# EAGLE design Outlet (EAGLE 7.5.0)
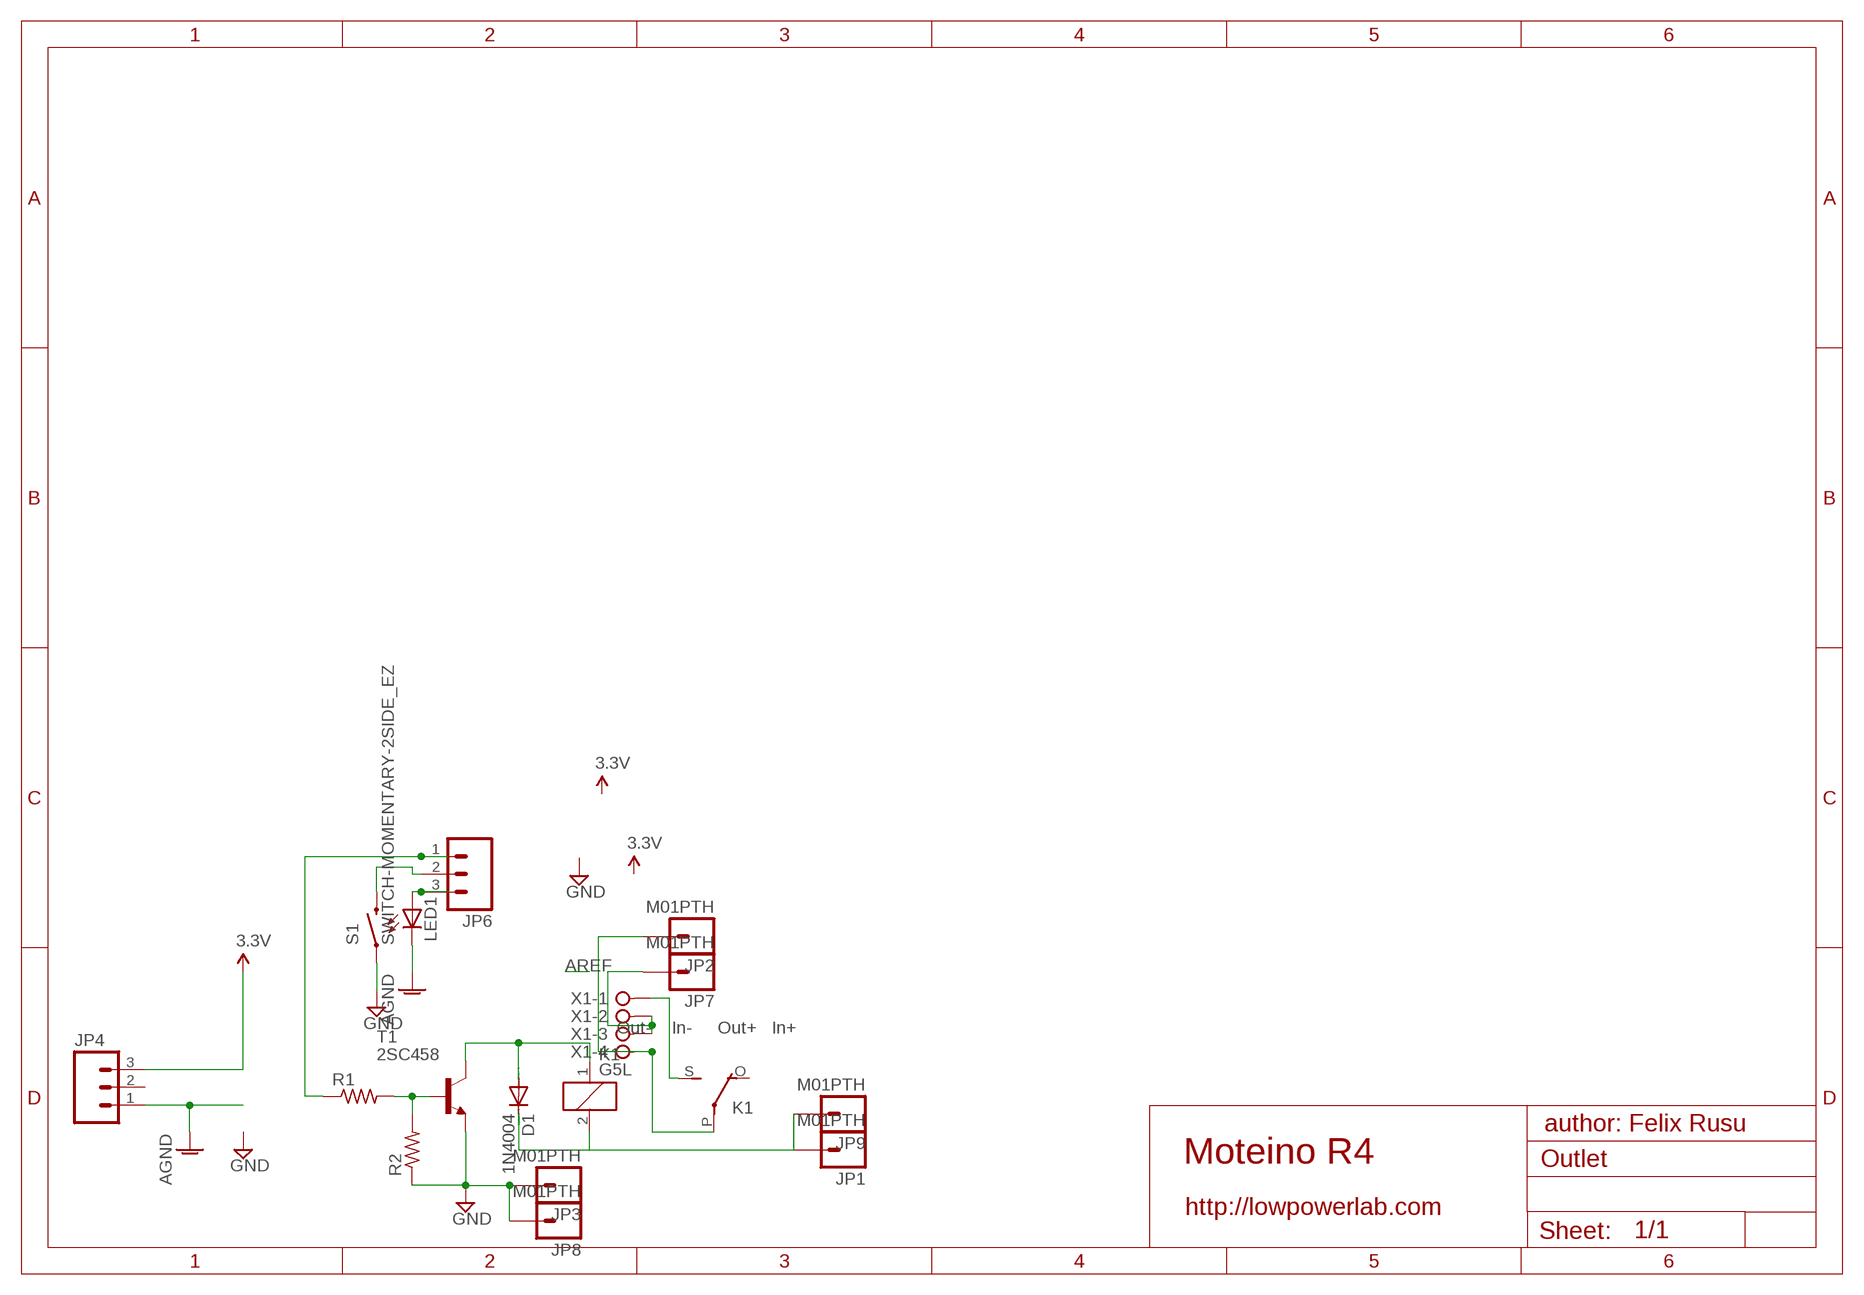
[diagram p0: schematic, sheet 1]

## Parts
D1  1N4004  [DO41-10]
JP1  M01PTH  [1X01]
JP2  M01PTH  [1X01]
JP3  M01PTH  [1X01]
JP4  M03PTH  [1X03]
JP6  M03PTH  [1X03]
JP7  M01PTH  [1X01]
JP8  M01PTH  [1X01]
JP9  M01PTH  [1X01]
K1  G5L  [G5LE]
LED1  LED3MM  [LED3MM]
R1  R-US_0204/7  [0204/7]
R2  R-US_0204/7  [0204/7]
S1  SWITCH-MOMENTARY-2SIDE_EZ  [TACTILE-PTH-SIDEEZ]
T1  2SC458  [TO92-ECB]
X1  Out- In- Out+ In+  W237-04P  [W237-4P]

## Nets
AGND [power]: JP4.1 LED1.K(C)
GND [power]: JP3.1 JP8.1 R2.1 S1.1 T1.E
N$1: JP6.2 S1.2
N$2: JP7.1 X1.2 X1.3
N$3: JP6.3 LED1.A
N$4: R1.2 R2.2 T1.B
N$6: D1.A K1.1 T1.C
N$7: D1.C JP1.1 JP9.1 K1.2
N$8: K1.S(2:S) X1.1
N$9: JP2.1 K1.P(2:P) X1.4
N$10: JP6.1 R1.1
VCC: JP4.3 ; supply symbol labelled 3.3V
Unconnected: JP4.2 K1.O(2:O)

## Notes on the sheet
- author: Felix Rusu
- Moteino R4
- http://lowpowerlab.com

## Library data of the parts
D1 = diode:1N4004: DIODE general purpose rectifier, 1 A
JP1-JP3 JP7-JP9 = SparkFun-Connectors:M01: Header 1 Standard 1-pin 0.1" header. Use with straight break away headers (SKU : PRT-00116), right angle break away headers (PRT-00553), swiss pins (PRT-00743), machine pins (PRT-00117), and female headers (PRT-00115).
JP4 JP6 = SparkFun-Connectors:M03: Header 3 Standard 3-pin 0.1" header. Use with straight break away headers (SKU : PRT-00116), right angle break away headers (PRT-00553), swiss pins (PRT-00743), machine pins (PRT-00117), and female headers (PRT-00115). Molex polarized connector foot print use with SKU : PRT-08232 with associated crimp pins and housings.
K1 = relay:G5L: RELAY 1 x switch, 10 A/120 V AC, 8 A/30 V ADC, Omron; OC_FARNELL: unknown; OC_NEWARK: unknown
LED1 = led:LED: LED OSRAM: - CHIPLED LG R971, LG N971, LY N971, LG Q971, LY Q971, LO R971, LY R971 LH N974, LH R974 LS Q976, LO Q976, LY Q976 LO Q996 - Hyper CHIPLED LW Q18S LB Q993, LB Q99A, LB R99A - SideLED LS A670, LO A670, LY A670, LG A670, LP A670 LB A673, LV A673, LT A673, LW A673 LH A674 LY A675 LS A676, LA A676, LO A676, LY A676, LW A676 LS A679, LY A679, LG A679 - Hyper Micro SIDELED® LS Y876, LA Y876, LO Y876, LY Y876 LT Y87S - SmartLED LW L88C, LW L88S LB L89C, LB L89S, LG L890 LS L89K, LO L89K, LY L89K LS L896, LA L896, LO L896, LY L896 - TOPLED LS T670, LO T670, LY T670, LG T670, LP T670 LSG T670, LSP T670, LSY T670, LOP T670, LYG T670 LG T671, LOG T671, LSG T671 LB T673, LV T673, LT T673, LW T673 LH T674 LS T676, LA T676, LO T676, LY T676, LB T676, LH T676, LSB T676, LW T676 LB T67C, LV T67C, LT T67C, LS T67K, LO T67K, LY T67K, LW E67C LS E67B, LA E67B, LO E67B, LY E67B, LB E67C, LV E67C, LT E67C LW T67C LS T679, LY T679, LG T679 LS T770, LO T770, LY T770, LG T770, LP T770 LB T773, LV T773, LT T773, LW T773 LH T774 LS E675, LA E675, LY E675, LS T675 LS T776, LA T776, LO T776, LY T776, LB T776 LHGB T686 LT T68C, LB T68C - Hyper Mini TOPLED® LB M676 - Mini TOPLED Santana® LG M470 LS M47K, LO M47K, LY M47K Source: http://www.osram.convergy.de LUXEON: - LUMILED® LXK2-PW12-R00, LXK2-PW12-S00, LXK2-PW14-U00, LXK2-PW14-V00 LXK2-PM12-R00, LXK2-PM12-S00, LXK2-PM14-U00 LXK2-PE12-Q00, LXK2-PE12-R00, LXK2-PE12-S00, LXK2-PE14-T00, LXK2-PE14-U00 LXK2-PB12-K00, LXK2-PB12-L00, LXK2-PB12-M00, LXK2-PB14-N00, LXK2-PB14-P00, LXK2-PB14-Q00 LXK2-PR12-L00, LXK2-PR12-M00, LXK2-PR14-Q00, LXK2-PR14-R00 LXK2-PD12-Q00, LXK2-PD12-R00, LXK2-PD12-S00 LXK2-PH12-R00, LXK2-PH12-S00 LXK2-PL12-P00, LXK2-PL12-Q00, LXK2-PL12-R00 Source: www.luxeon.com KINGBRIGHT: KA-3528ASYC Source: www.kingbright.com
R1 R2 = resistor:R-US_: RESISTOR, American symbol
S1 = SparkFun-Electromechanical:SWITCH-MOMENTARY-2: Various NO switches- pushbuttons, reed, etc
T1 = transistor:2SC458: NPN Silicon Epitaxial Planar Transistor Source: SEMTECH ELECTRONICS LTD. ... 2SC458 1.pdf
X1 = con-wago-508:W237-04P: WAGO SREW CLAMP; MF: In-; MPN: Out-; OC_FARNELL: unknown; OC_NEWARK: unknown

## Net classes
1 power: width 0.381 mm, clearance 0.254 mm

## Board
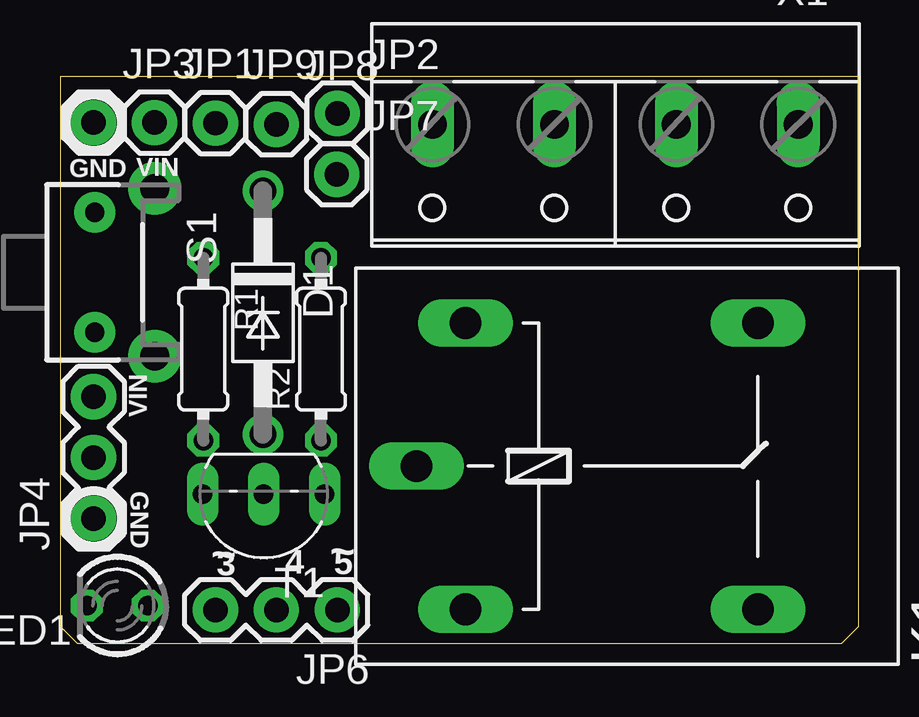
[diagram p1: board, top side]
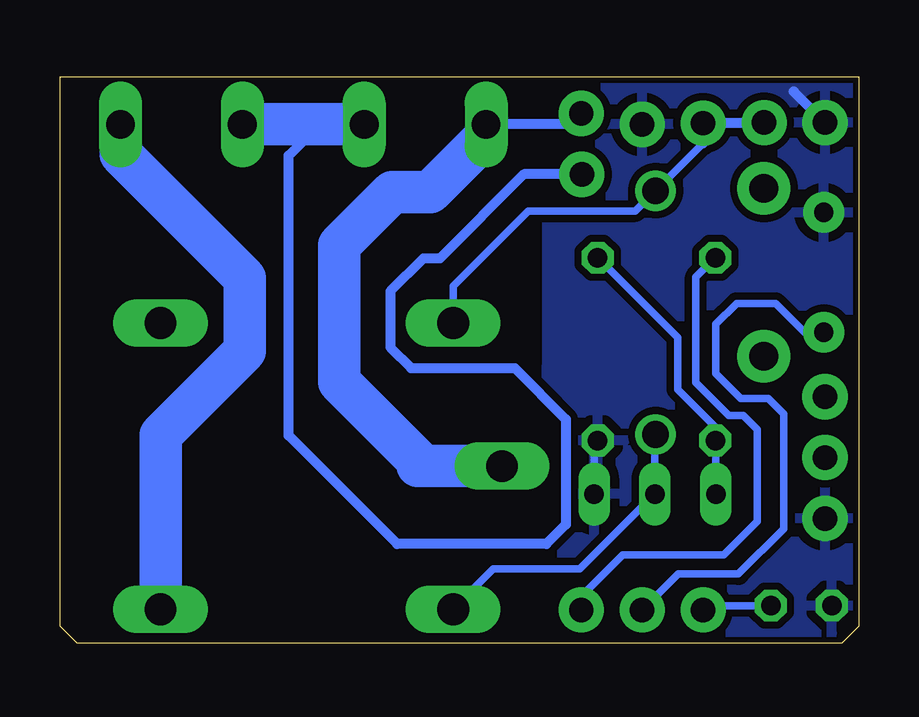
[diagram p2: board, bottom side, seen from below]

Size 33.27 x 23.62 mm. Coordinates in mm from the lower left corner, seen from the top.
Outline: 0.71,0 32.56,0 33.27,0.71 33.27,23.62 0,23.62 0,0.71 0.71,0
Copper layers (1*16): Top 0.035mm / dielectric 1.5mm / Bottom 0.035mm
Design rules "ITEADstudio_DRC *": minimum track width 6mil, minimum drill 12mil, track to track 12mil, track to pad 12mil, pad to pad 6mil, via to via 6mil, smd to smd 0mil, copper to edge 10mil, drill to drill 10mil, minimum pad ring 10mil, minimum via ring 6mil, stop-mask expansion 2mil, vias tented up to drill 100mil, thermal gap 15mil

### Footprints (pad centres in the part's own frame; a part is rotated, then mirrored left to right if it is on the bottom)
DO41-10 = drill 1.118: A 5.08,0; C -5.08,0
1X01 = drill 1.016 pad 1.88: 1 0,0
1X03 = drill 1.016 pad 1.88: 1 0,0; 2 2.54,0; 3 5.08,0
G5LE = drill 1.321 long: 1 -7.493,-5.969; 2 -7.493,5.969; O 4.699,5.969; P -9.525,0; S 4.699,-5.969
LED3MM = drill 0.813 octagon: A -1.27,0; K 1.27,0
0204/7 = drill 0.813 octagon: 1 -3.81,0; 2 3.81,0
TACTILE-PTH-SIDEEZ = drill 0.8 pad 1.7: 1 -2.5,0; 2 2.5,0 | drill 1.2 pad 2.2: ANCHOR1 -3.5,2.5; ANCHOR2 3.5,2.5
TO92-ECB = drill 0.813 long: B 2.54,0; C 0,0; E -2.54,0
W237-4P = drill 1.194 long: 1 -7.62,-0.635; 2 -2.54,-0.635; 3 2.54,-0.635; 4 7.62,-0.635

### Placement (x,y rotation side)
D1  8.46,13.79 270 top
JP1  3.94,21.72 0 top
JP2  11.56,22.1 0 top
JP3  1.4,21.72 0 top
JP4  1.4,5.21 90 top
JP6  11.56,1.4 180 top
JP7  11.53,19.56 0 top
JP8  9.02,21.64 0 top
JP9  6.48,21.69 0 top
K1  24.38,7.39 0 top
LED1  2.39,1.57 180 top
R1  5.97,12.27 270 top
R2  10.87,12.27 90 top
S1  1.45,15.47 270 top
T1  8.48,6.22 180 top
X1  23.14,21.01 180 top

### Tracks (layer width: path | path; a pad name or v marks a point on that pad's centre or on a via)
AGND
  pour Bottom: -0.23,23.75 13.44,23.7 13.44,-0.51 -0.3,-0.46 -0.3,23.72
GND
  Bottom 0.305: T1.E 11.02,8.31 R2.1
  Bottom 0.406: JP3.1 2.69,23.01 2.72,23.01
  pour Bottom: -0.23,23.52 12.98,23.57 13.03,-0.3 -0.13,-0.18
N$1
  Bottom 0.305: S1.2 2.25,12.97 3.45,14.17 5.08,14.17 5.94,13.31 5.94,11.25 4.9,10.21 3.76,10.21 3.12,9.58 3.12,4.78 5,2.9 7.52,2.9 JP6.2
N$2
  Bottom 0.406: JP7.1 13.95,19.56 17.45,16.05 18.14,16.05 19.51,14.68 19.51,12.34 18.64,11.48 14.33,11.48 12.19,9.35 12.19,4.95 13.01,4.14 19.23,4.14 23.75,8.66 23.75,20.34 22.45,21.64
  Bottom 1.778: X1.3 22.45,21.64 X1.2
N$3
  Bottom 0.305: LED1.A 6.3,1.57 JP6.3
N$4
  Bottom 0.305: T1.B 5.94,8.43 R1.2 5.97,9.02 7.54,10.59 7.54,12.75 R2.2
N$6
  Bottom 0.305: D1.A 8.48,8.59 T1.C 11.61,3.1 15.21,3.1 K1.1
N$7
  Bottom 0.305: 6.48,20.85 D1.C 9.3,18.03 13.77,18.03 16.89,14.91 K1.2 | JP1.1 4.01,21.64
  Bottom 0.406: 4.01,21.64 4.06,21.69 JP9.1 6.48,20.85
N$8
  Bottom 1.778: K1.S 29.08,8.69 25.58,12.19 25.58,15.24 30.73,20.4 X1.1
N$9
  Bottom 0.406: JP2.1 12.01,21.64 X1.4
  Bottom 1.778: 18.36,7.39 18.14,7.39 | 18.14,7.39 K1.P | 18.14,7.39 21.64,10.9 21.64,16.61 19.43,18.82 17.86,18.82 15.52,21.16 X1.4
N$10
  Bottom 0.305: JP6.1 11.56,1.96 9.83,3.68 5.61,3.68 4.22,5.08 4.22,8.91 4.8,9.5 5.41,9.5 6.78,10.87 6.78,15.27 R1.1

### Text on the board
_tsilk: VIN | GND | VIN | GND | 3 | 4 | 5 | ~ | ~